# Altium project learning_altium.PrjPcb
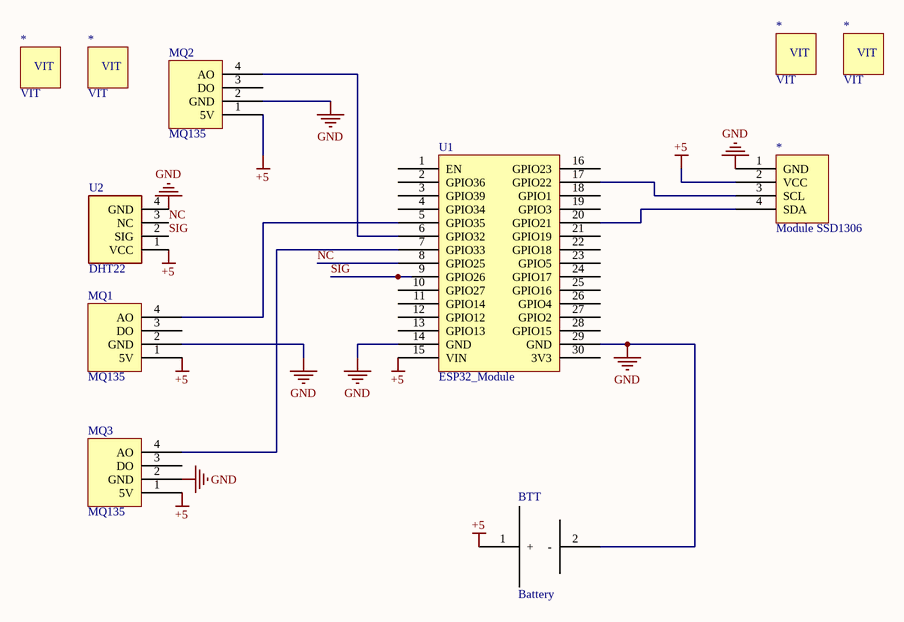
[diagram p0: Sheet1.SchDoc]
1 sheet, 11 parts. Net scope: global (net labels, ports and power ports of the same name join across sheets).
Board file: PCB1.PcbDoc

## Sheet Sheet1.SchDoc
size A; SheetNumber: 1; SheetTotal: 1

### Parts
(Parts that share a designator on the sheet are numbered #1, #2 ... from top to bottom, then left to right.)
*#1  VIT  [VIT]
*#2  VIT  [VIT]
*#3  VIT  [VIT]
*#4  VIT  [VIT]
*#5  Module SSD1306  [Module SSD1306]
BTT  Battery  [Battery]
MQ1  MQ135  [MQ135]
MQ2  MQ135  [MQ135]
MQ3  MQ135  [MQ135]
U1  ESP32_Module  [ESP32_Module]
U2  DHT22  [DHT22_180]

### Nets
+5: *#5.2(VCC) BTT.1(+) MQ1.1(5V) MQ2.1(5V) MQ3.1(5V) U1.15(VIN) U2.1(VCC)
GND: *#5.1(GND) BTT.2(-) MQ1.2(GND) MQ2.2(GND) MQ3.2(GND) U1.14(GND) U1.29(GND) U2.4(GND)
NC: U1.8(GPIO25) U2.3(NC)
SIG: U1.9(GPIO26) U2.2(SIG)
Net*#5_3: *#5.3(SCL) U1.17(GPIO22)
Net*#5_4: *#5.4(SDA) U1.20(GPIO21)
NetMQ1_4: MQ1.4(AO) U1.5(GPIO35)
NetMQ2_4: MQ2.4(AO) U1.6(GPIO32)
NetMQ3_4: MQ3.4(AO) U1.7(GPIO33)

Not connected (* = marked no-connect by the designer): MQ1 3(DO); MQ2 3(DO); MQ3 3(DO); U1 1(EN) 2(GPIO36) 3(GPIO39) 4(GPIO34) 10(GPIO27) 11(GPIO14) 12(GPIO12) 13(GPIO13) 16(GPIO23) 18(GPIO1) 19(GPIO3) 21(GPIO19) 22(GPIO18) 23(GPIO5) 24(GPIO17) 25(GPIO16) 26(GPIO4) 27(GPIO2) 28(GPIO15) 30(3V3)

### Library data of the parts
U2 = DHT22: SENSOR HUMIDITY/TEMPERATURE; Digikey PN: 1528-1228-ND